# Altium project PCB_3U_CamLink.PrjPCB
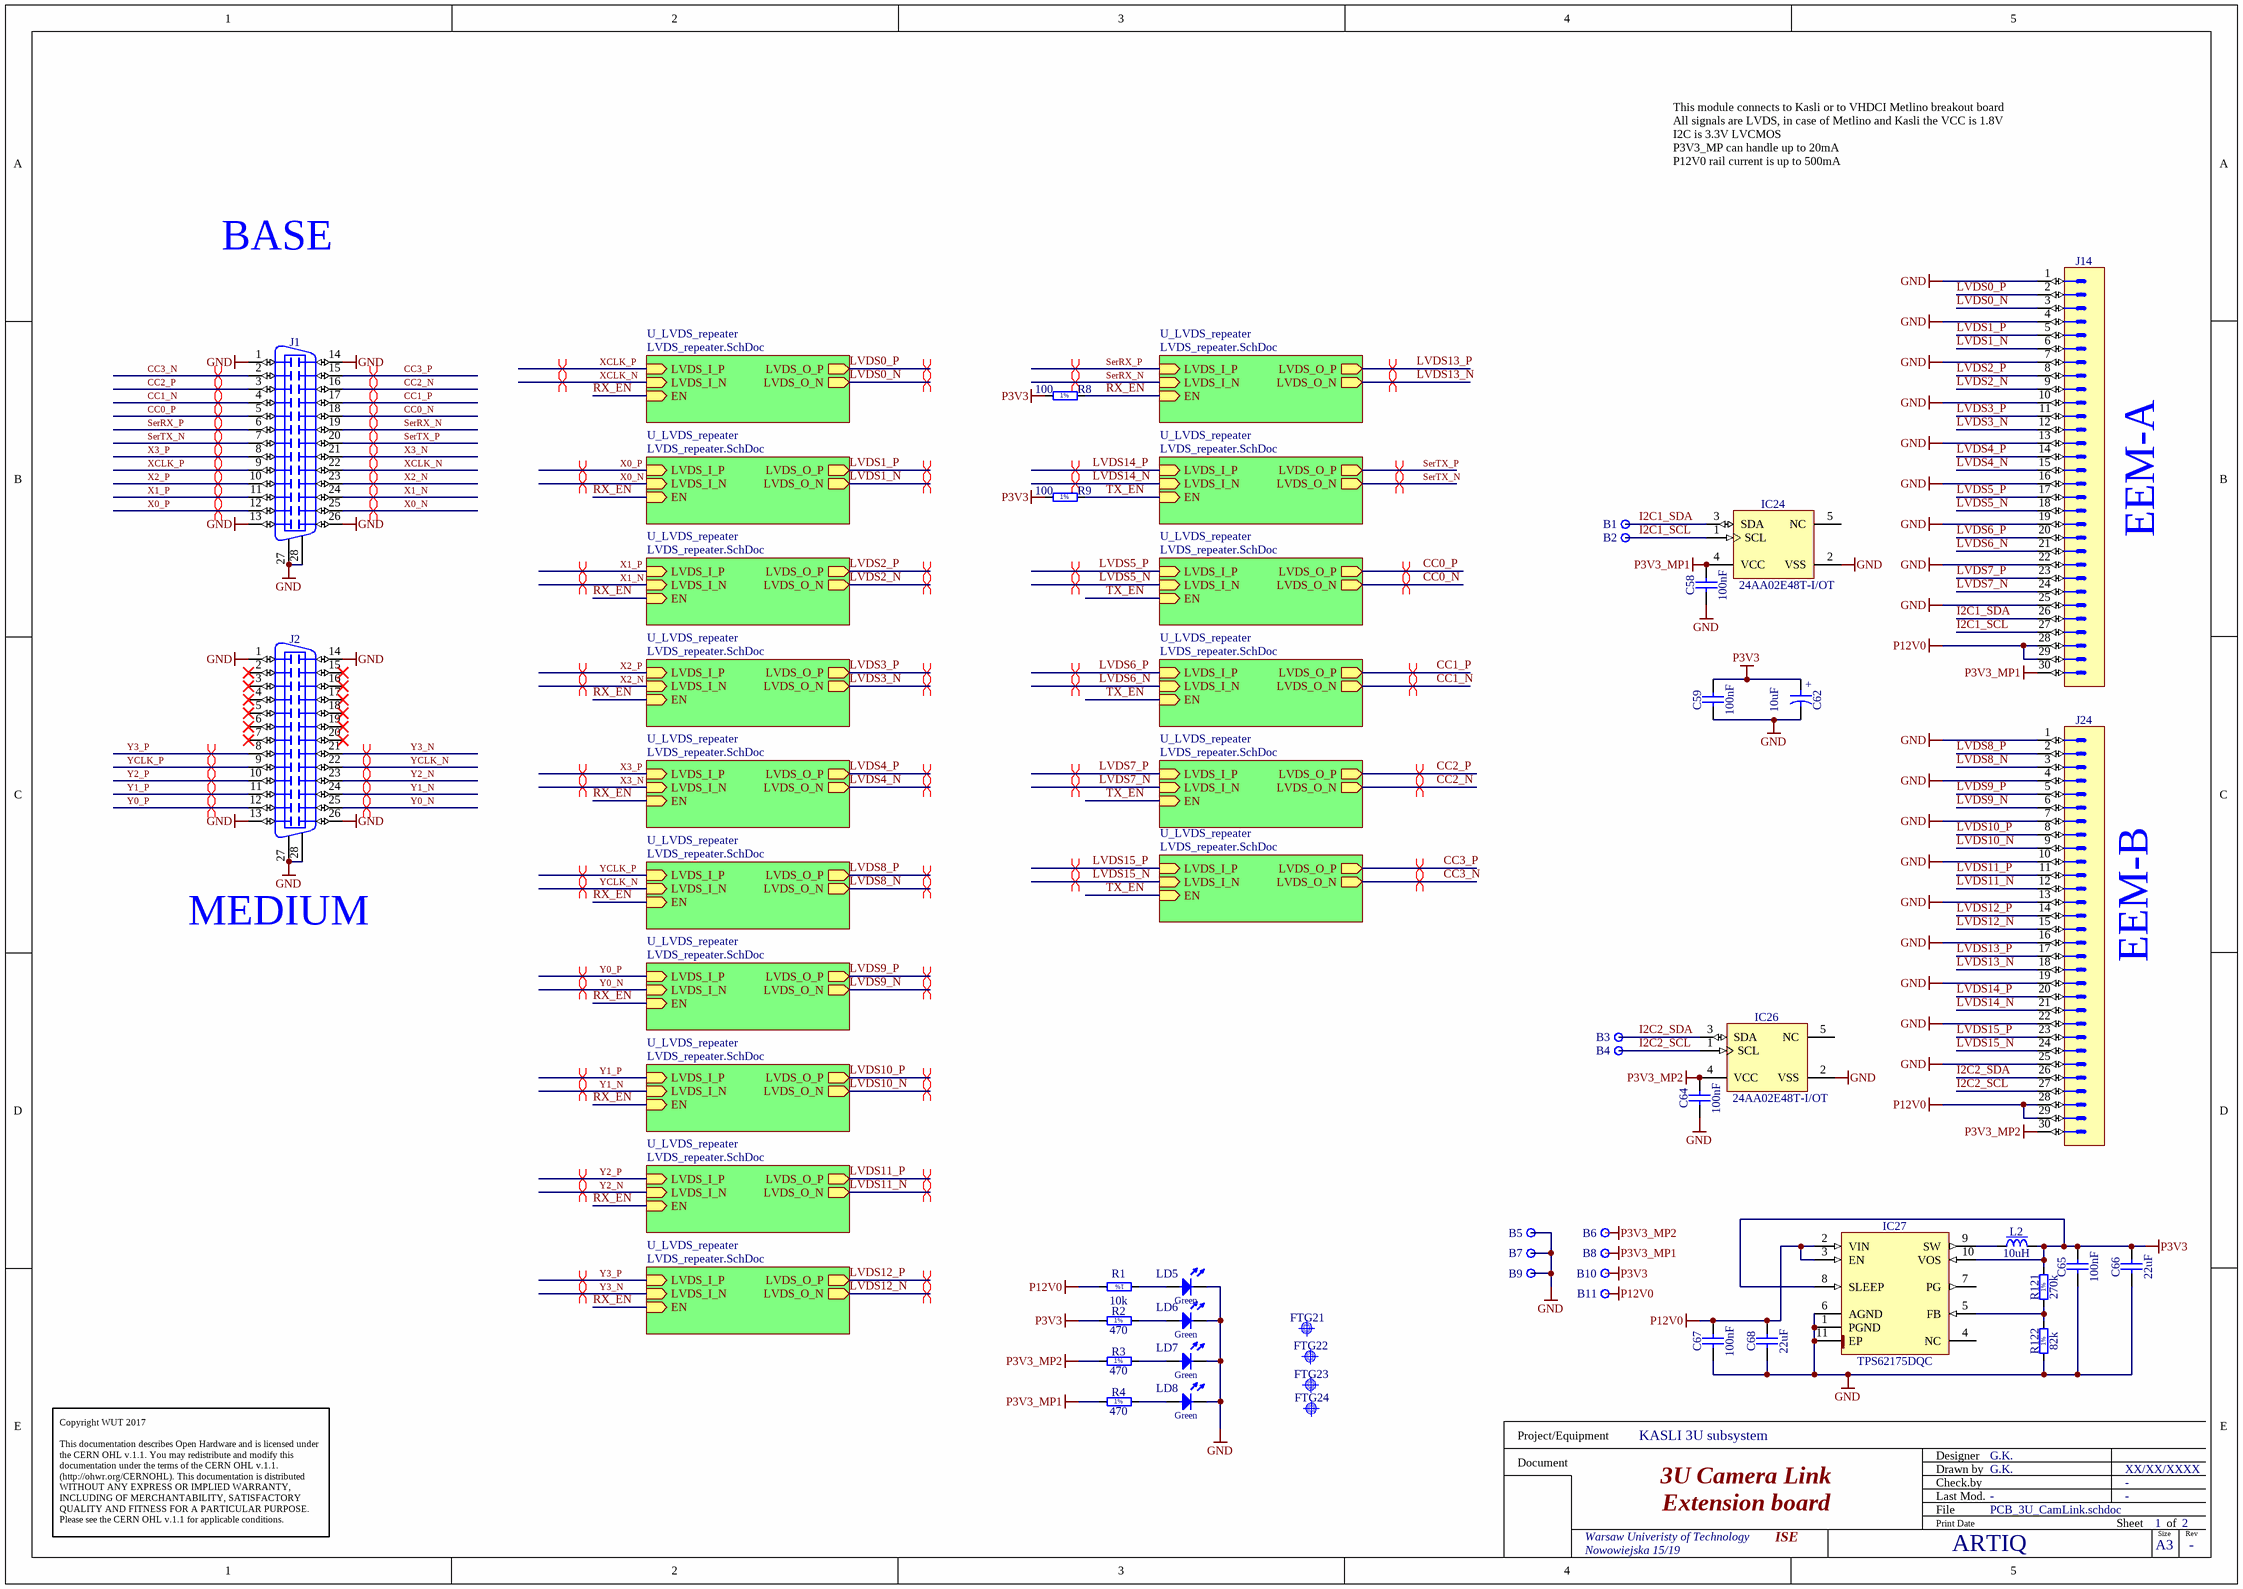
[diagram p0: PCB_3U_CamLink.schdoc]
2 sheets, 107 parts. Net scope: hierarchical (ports join the sheet entries above them; power ports are global).
Board file: PCB_3U_CamLink.PCBDOC
Sheets:
  PCB_3U_CamLink.schdoc
    U_LVDS_repeater = LVDS_repeater.SchDoc
    U_LVDS_repeater = LVDS_repeater.SchDoc
    U_LVDS_repeater = LVDS_repeater.SchDoc
    U_LVDS_repeater = LVDS_repeater.SchDoc
    U_LVDS_repeater = LVDS_repeater.SchDoc
    U_LVDS_repeater = LVDS_repeater.SchDoc
    U_LVDS_repeater = LVDS_repeater.SchDoc
    U_LVDS_repeater = LVDS_repeater.SchDoc
    U_LVDS_repeater = LVDS_repeater.SchDoc
    U_LVDS_repeater = LVDS_repeater.SchDoc
    U_LVDS_repeater = LVDS_repeater.SchDoc
    U_LVDS_repeater = LVDS_repeater.SchDoc
    U_LVDS_repeater = LVDS_repeater.SchDoc
    U_LVDS_repeater = LVDS_repeater.SchDoc
    U_LVDS_repeater = LVDS_repeater.SchDoc
    U_LVDS_repeater = LVDS_repeater.SchDoc

## Sheet PCB_3U_CamLink.schdoc: 3U Camera Link
size 420 x 297 mm; Author: G.K.; CompanyName: WUT; DrawnBy: G.K.; Organization: WUT; Address1: Warsaw Univeristy of Technology; Address2: Nowowiejska 15/19; DocumentNumber: 1; Revision: -; SheetNumber: 1; SheetTotal: 2; EDA_Number: ARTIQ; Projet: KASLI 3U subsystem; ModifiedBy: -; CreateDate: XX/XX/XXXX; CheckedDate: -; Title2: Extension board; DivGrp: ISE; Designer: G.K.; ModifiedDate: -; ProjectName: KASLI 3U subsystem

### Parts
B1  Plated Hole  [c130h60]  (value not drawn)
B2  Plated Hole  [c130h60]  (value not drawn)
B3  Plated Hole  [c130h60]  (value not drawn)
B4  Plated Hole  [c130h60]  (value not drawn)
B5  Plated Hole  [c130h60]  (value not drawn)
B6  Plated Hole  [c130h60]  (value not drawn)
B7  Plated Hole  [c130h60]  (value not drawn)
B8  Plated Hole  [c130h60]  (value not drawn)
B9  Plated Hole  [c130h60]  (value not drawn)
B10  Plated Hole  [c130h60]  (value not drawn)
B11  Plated Hole  [c130h60]  (value not drawn)
C58  100nF  [CAPC1005X55N]
C59  100nF  [CAPC1005X55N]
C62  10uF  [CAPAE430X540N]
C64  100nF  [CAPC1005X55N]
C65  100nF  [CAPC1005X55N]
C66  22uF  [CAPC2012X135N]
C67  100nF  [CAPC1005X55N]
C68  22uF  [CAPC2012X135N]
FTG21  Use only in PCB  [FIDUCIAL_TOP_C100-200]  (value not drawn)
FTG22  Use only in PCB  [FIDUCIAL_TOP_S100-200]  (value not drawn)
FTG23  Use only in PCB  [FIDUCIAL_TOP_S200-400]  (value not drawn)
FTG24  Use only in PCB  [FIDUCIAL_TOP_S100-200]  (value not drawn)
IC24  24AA02E48T-I/OT  [SOT95P280X145-5N]
IC26  24AA02E48T-I/OT  [SOT95P280X145-5N]
IC27  TPS62175DQC  [SON50P200X300X80-11N-R94X250]
J1  MDR 26  [3M_N10226-5212PC]  (value not drawn)
J2  MDR 26  [3M_N10226-5212PC]  (value not drawn)
J14  (no value)  [3M_N2530-6002RB]
J24  (no value)  [3M_N2530-6002RB]
L2  10uH  [IND_MURATA-PS_8400]
LD5  Green  [LED_KINGBRIGHT_KPH-1608CGCK]  (value not drawn)
LD6  Green  [LED_KINGBRIGHT_KPH-1608CGCK]  (value not drawn)
LD7  Green  [LED_KINGBRIGHT_KPH-1608CGCK]  (value not drawn)
LD8  Green  [LED_KINGBRIGHT_KPH-1608CGCK]  (value not drawn)
R1  10k  [RESC1005X40N]
R2  470  [RESC1005X40N]
R3  470  [RESC1005X40N]
R4  470  [RESC1005X40N]
R8  100  [RESC1005X40N]
R9  100  [RESC1005X40N]
R121  270k  [RESC1608X55N]
R122  82k  [RESC1608X55N]

### Sub-sheets
U_LVDS_repeater = LVDS_repeater.SchDoc: LVDS_I_P (in), LVDS_I_N (in), LVDS_O_P (out), LVDS_O_N (out), EN (in)
U_LVDS_repeater = LVDS_repeater.SchDoc: LVDS_I_P (in), LVDS_I_N (in), LVDS_O_P (out), LVDS_O_N (out), EN (in)
U_LVDS_repeater = LVDS_repeater.SchDoc: LVDS_I_P (in), LVDS_I_N (in), LVDS_O_P (out), LVDS_O_N (out), EN (in)
U_LVDS_repeater = LVDS_repeater.SchDoc: LVDS_I_P (in), LVDS_I_N (in), LVDS_O_P (out), LVDS_O_N (out), EN (in)
U_LVDS_repeater = LVDS_repeater.SchDoc: LVDS_I_P (in), LVDS_I_N (in), LVDS_O_P (out), LVDS_O_N (out), EN (in)
U_LVDS_repeater = LVDS_repeater.SchDoc: LVDS_I_P (in), LVDS_I_N (in), LVDS_O_P (out), LVDS_O_N (out), EN (in)
U_LVDS_repeater = LVDS_repeater.SchDoc: LVDS_I_P (in), LVDS_I_N (in), LVDS_O_P (out), LVDS_O_N (out), EN (in)
U_LVDS_repeater = LVDS_repeater.SchDoc: LVDS_I_P (in), LVDS_I_N (in), LVDS_O_P (out), LVDS_O_N (out), EN (in)
U_LVDS_repeater = LVDS_repeater.SchDoc: LVDS_I_P (in), LVDS_I_N (in), LVDS_O_P (out), LVDS_O_N (out), EN (in)
U_LVDS_repeater = LVDS_repeater.SchDoc: LVDS_I_P (in), LVDS_I_N (in), LVDS_O_P (out), LVDS_O_N (out), EN (in)
U_LVDS_repeater = LVDS_repeater.SchDoc: LVDS_I_P (in), LVDS_I_N (in), LVDS_O_P (out), LVDS_O_N (out), EN (in)
U_LVDS_repeater = LVDS_repeater.SchDoc: LVDS_I_P (in), LVDS_I_N (in), LVDS_O_P (out), LVDS_O_N (out), EN (in)
U_LVDS_repeater = LVDS_repeater.SchDoc: LVDS_I_P (in), LVDS_I_N (in), LVDS_O_P (out), LVDS_O_N (out), EN (in)
U_LVDS_repeater = LVDS_repeater.SchDoc: LVDS_I_P (in), LVDS_I_N (in), LVDS_O_P (out), LVDS_O_N (out), EN (in)
U_LVDS_repeater = LVDS_repeater.SchDoc: LVDS_I_P (in), LVDS_I_N (in), LVDS_O_P (out), LVDS_O_N (out), EN (in)
U_LVDS_repeater = LVDS_repeater.SchDoc: LVDS_I_P (in), LVDS_I_N (in), LVDS_O_P (out), LVDS_O_N (out), EN (in)

### Nets
GND: B5.1 B7.1 B9.1 C58.1 C59.1 C62.2 C64.1 C65.1 C66.1 C67.1 C68.1 IC24.2(VSS) IC26.2(VSS) IC27.1(PGND) IC27.6(AGND) IC27.11(EP) J1.1 J1.13 J1.14 J1.26 J1.27 J1.28 J2.1 J2.13 J2.14 J2.26 J2.27 J2.28 J14.1 J14.4 J14.7 J14.10 J14.13 J14.16 J14.19 J14.22 J14.25 J24.1 J24.4 J24.7 J24.10 J24.13 J24.16 J24.19 J24.22 J24.25 LD5.1(C) LD6.1(C) LD7.1(C) LD8.1(C) R122.1
P3V3: B10.1 C59.2 C62.1 C65.2 C66.2 IC27.8(SLEEP) IC27.10(VOS) L2.2 R2.1 R8.1 R9.1 R121.2
P3V3_MP1: B8.1 C58.2 IC24.4(VCC) J14.30 R4.1
P3V3_MP2: B6.1 C64.2 IC26.4(VCC) J24.30 R3.1
P12V0: B11.1 C67.2 C68.2 IC27.2(VIN) IC27.3(EN) J14.28 J14.29 J24.28 J24.29 R1.2
CC0_N: J1.18 ; sheet U_LVDS_repeater/LVDS_O_N
CC0_P: J1.5 ; sheet U_LVDS_repeater/LVDS_O_P
CC1_N: J1.4 ; sheet U_LVDS_repeater/LVDS_O_N
CC1_P: J1.17 ; sheet U_LVDS_repeater/LVDS_O_P
CC2_N: J1.16 ; sheet U_LVDS_repeater/LVDS_O_N
CC2_P: J1.3 ; sheet U_LVDS_repeater/LVDS_O_P
CC3_N: J1.2 ; sheet U_LVDS_repeater/LVDS_O_N
CC3_P: J1.15 ; sheet U_LVDS_repeater/LVDS_O_P
I2C1_SCL: B2.1 IC24.1(SCL) J14.27
I2C1_SDA: B1.1 IC24.3(SDA) J14.26
I2C2_SCL: B4.1 IC26.1(SCL) J24.27
I2C2_SDA: B3.1 IC26.3(SDA) J24.26
LVDS0_N: J14.3 ; sheet U_LVDS_repeater/LVDS_O_N
LVDS0_P: J14.2 ; sheet U_LVDS_repeater/LVDS_O_P
LVDS1_N: J14.6 ; sheet U_LVDS_repeater/LVDS_O_N
LVDS1_P: J14.5 ; sheet U_LVDS_repeater/LVDS_O_P
LVDS2_N: J14.9 ; sheet U_LVDS_repeater/LVDS_O_N
LVDS2_P: J14.8 ; sheet U_LVDS_repeater/LVDS_O_P
LVDS3_N: J14.12 ; sheet U_LVDS_repeater/LVDS_O_N
LVDS3_P: J14.11 ; sheet U_LVDS_repeater/LVDS_O_P
LVDS4_N: J14.15 ; sheet U_LVDS_repeater/LVDS_O_N
LVDS4_P: J14.14 ; sheet U_LVDS_repeater/LVDS_O_P
LVDS5_N: J14.18 ; sheet U_LVDS_repeater/LVDS_I_N
LVDS5_P: J14.17 ; sheet U_LVDS_repeater/LVDS_I_P
LVDS6_N: J14.21 ; sheet U_LVDS_repeater/LVDS_I_N
LVDS6_P: J14.20 ; sheet U_LVDS_repeater/LVDS_I_P
LVDS7_N: J14.24 ; sheet U_LVDS_repeater/LVDS_I_N
LVDS7_P: J14.23 ; sheet U_LVDS_repeater/LVDS_I_P
LVDS8_N: J24.3 ; sheet U_LVDS_repeater/LVDS_O_N
LVDS8_P: J24.2 ; sheet U_LVDS_repeater/LVDS_O_P
LVDS9_N: J24.6 ; sheet U_LVDS_repeater/LVDS_O_N
LVDS9_P: J24.5 ; sheet U_LVDS_repeater/LVDS_O_P
LVDS10_N: J24.9 ; sheet U_LVDS_repeater/LVDS_O_N
LVDS10_P: J24.8 ; sheet U_LVDS_repeater/LVDS_O_P
LVDS11_N: J24.12 ; sheet U_LVDS_repeater/LVDS_O_N
LVDS11_P: J24.11 ; sheet U_LVDS_repeater/LVDS_O_P
LVDS12_N: J24.15 ; sheet U_LVDS_repeater/LVDS_O_N
LVDS12_P: J24.14 ; sheet U_LVDS_repeater/LVDS_O_P
LVDS13_N: J24.18 ; sheet U_LVDS_repeater/LVDS_O_N
LVDS13_P: J24.17 ; sheet U_LVDS_repeater/LVDS_O_P
LVDS14_N: J24.21 ; sheet U_LVDS_repeater/LVDS_I_N
LVDS14_P: J24.20 ; sheet U_LVDS_repeater/LVDS_I_P
LVDS15_N: J24.24 ; sheet U_LVDS_repeater/LVDS_I_N
LVDS15_P: J24.23 ; sheet U_LVDS_repeater/LVDS_I_P
RX_EN: R8.2 ; sheet U_LVDS_repeater/EN, sheet U_LVDS_repeater/EN, sheet U_LVDS_repeater/EN, sheet U_LVDS_repeater/EN, sheet U_LVDS_repeater/EN, sheet U_LVDS_repeater/EN, sheet U_LVDS_repeater/EN, sheet U_LVDS_repeater/EN, sheet U_LVDS_repeater/EN, sheet U_LVDS_repeater/EN, sheet U_LVDS_repeater/EN
SerRX_N: J1.19 ; sheet U_LVDS_repeater/LVDS_I_N  [project net LVDS_I_N]
SerRX_P: J1.6 ; sheet U_LVDS_repeater/LVDS_I_P  [project net LVDS_I_P]
SerTX_N: J1.7 ; sheet U_LVDS_repeater/LVDS_O_N  [project net LVDS_O_N]
SerTX_P: J1.20 ; sheet U_LVDS_repeater/LVDS_O_P  [project net LVDS_O_P]
TX_EN: R9.2 ; sheet U_LVDS_repeater/EN, sheet U_LVDS_repeater/EN, sheet U_LVDS_repeater/EN, sheet U_LVDS_repeater/EN, sheet U_LVDS_repeater/EN
X0_N: J1.25 ; sheet U_LVDS_repeater/LVDS_I_N  [project net LVDS_I_N]
X0_P: J1.12 ; sheet U_LVDS_repeater/LVDS_I_P  [project net LVDS_I_P]
X1_N: J1.24 ; sheet U_LVDS_repeater/LVDS_I_N  [project net LVDS_I_N]
X1_P: J1.11 ; sheet U_LVDS_repeater/LVDS_I_P  [project net LVDS_I_P]
X2_N: J1.23 ; sheet U_LVDS_repeater/LVDS_I_N  [project net LVDS_I_N]
X2_P: J1.10 ; sheet U_LVDS_repeater/LVDS_I_P  [project net LVDS_I_P]
X3_N: J1.21 ; sheet U_LVDS_repeater/LVDS_I_N  [project net LVDS_I_N]
X3_P: J1.8 ; sheet U_LVDS_repeater/LVDS_I_P  [project net LVDS_I_P]
XCLK_N: J1.22 ; sheet U_LVDS_repeater/LVDS_I_N  [project net LVDS_I_N]
XCLK_P: J1.9 ; sheet U_LVDS_repeater/LVDS_I_P  [project net LVDS_I_P]
Y0_N: J2.25 ; sheet U_LVDS_repeater/LVDS_I_N  [project net LVDS_I_N]
Y0_P: J2.12 ; sheet U_LVDS_repeater/LVDS_I_P  [project net LVDS_I_P]
Y1_N: J2.24 ; sheet U_LVDS_repeater/LVDS_I_N  [project net LVDS_I_N]
Y1_P: J2.11 ; sheet U_LVDS_repeater/LVDS_I_P  [project net LVDS_I_P]
Y2_N: J2.23 ; sheet U_LVDS_repeater/LVDS_I_N  [project net LVDS_I_N]
Y2_P: J2.10 ; sheet U_LVDS_repeater/LVDS_I_P  [project net LVDS_I_P]
Y3_N: J2.21 ; sheet U_LVDS_repeater/LVDS_I_N  [project net LVDS_I_N]
Y3_P: J2.8 ; sheet U_LVDS_repeater/LVDS_I_P  [project net LVDS_I_P]
YCLK_N: J2.22 ; sheet U_LVDS_repeater/LVDS_I_N  [project net LVDS_I_N]
YCLK_P: J2.9 ; sheet U_LVDS_repeater/LVDS_I_P  [project net LVDS_I_P]
NetIC27_5: IC27.5(FB) R121.1 R122.2
NetIC27_9: IC27.9(SW) L2.1
NetLD5_2: LD5.2(A) R1.1
NetLD6_2: LD6.2(A) R2.2
NetLD7_2: LD7.2(A) R3.2
NetLD8_2: LD8.2(A) R4.2

Not connected (* = marked no-connect by the designer): IC24 5(NC); IC26 5(NC); IC27 4(NC) 7(PG); J2 2* 3* 4* 5* 6* 7* 15* 16* 17* 18* 19* 20*

### Layout directives
differential pair: CC0_N, CC0_P, CC1_N, CC1_P, CC2_N, CC2_P, CC3_N, CC3_P, LVDS0_N, LVDS0_P, LVDS1_N, LVDS1_P, LVDS2_N, LVDS2_P, LVDS3_N, LVDS3_P, LVDS4_N, LVDS4_P, LVDS5_N, LVDS5_P, LVDS6_N, LVDS6_P, LVDS7_N, LVDS7_P, LVDS8_N, LVDS8_P, LVDS9_N, LVDS9_P, LVDS10_N, LVDS10_P, LVDS11_N, LVDS11_P, LVDS12_N, LVDS12_P, LVDS13_N, LVDS13_P, LVDS14_N, LVDS14_P, LVDS15_N, LVDS15_P, LVDS_I_N, LVDS_I_P, LVDS_O_N, LVDS_O_P

### Notes on the sheet
- This module connects to Kasli or to VHDCI Metlino breakout board
  All signals are LVDS, in case of Metlino and Kasli the VCC is 1.8V
  I2C is 3.3V LVCMOS
  P3V3_MP can handle up to 20mA
  P12V0 rail current is up to 500mA
- BASE
- (near J14) EEM-A
- (near J2) MEDIUM
- (near J24) EEM-B
- Copyright WUT 2017
  This documentation describes Open Hardware and is licensed under the CERN OHL v.1.1. You may redistribute and modify this documentation under the terms of the CERN OHL v.1.1. (http://ohwr.org/CERNOHL). This documentation is distributed WITHOUT ANY EXPRESS OR IMPLIED WARRANTY, INCLUDING OF MERCHANTABILITY, SATISFACTORY QUALITY AND FITNESS FOR A PARTICULAR PURPOSE. Please see the CERN OHL v.1.1 for applicable conditions.
- Project/Equipment
- Document
- Designer
- Drawn by
- Check.by
- File
- Last Mod.
- Print Date
- Sheet
- Size
- A3
- of
- Rev
- (in symbol CAE430-540_10UF_16V_20%) +
- (in symbol R0402_10K_1%_0.0625W_100PPM) 1%
- (in symbol R0402_100R_1%_0.1W_100PPM) 1%
- (in symbol R0402_470R_1%_0.0625W_100PPM) 1%
- (in symbol R0603_82K_1%_0.1W_100PPM) 1%
- (in symbol R0603_270K_1%_0.1W_100PPM) 1%

### Library data of the parts
B1-B11 = PLATED_HOLE0.6_PAD1.3: Single Terminal Socket; Part Description: Plated Through Hole: Hole Dia.=0.6mm Pad Dia.=1.3mm; Mounted: No; Part Number: PLATED_HOLE0.6_PAD1.3; Component Kind: Standard (No BOM); Component Type: Standard (No BOM); Pin Count: 1; Family: Plated Hole; Socket: No; SMD: No; Sense: No; Status: None; ComponentHeight: 0mm; HelpURL: Undefined; Author: CERN DEM MR; CreateDate: 02.03.2016; LatestRevisionDate: 02.03.2016; PackageDescription: Plated Through Hole: Hole Dia.=0.6mm Pad Dia.=1.3mm
C58 C59 C64 C65 C67 = CC0402_100NF_16V_10%_X5R: Non-polarised capacitor; Part Description: SMD Multilayer Chip Ceramic Capacitor; Manufacturer: GENERIC; Manufacturer1 Part Number: GRM155R61C104KA88D; Voltage: 16V; TC: X5R; Tolerance: ±10%; Part Number: CC0402_100NF_16V_10%_X5R; Component Kind: Standard; Component Type: Standard; Pin Count: 2; Value: 100nF; Status: None; Manufacturer Part Number: CC0402_100NF_16V_10%_X5R; Case: 0402; Mounted: Yes; Socket: No; SMD: Yes; Sense: No; Manufacturer1 Example: MURATA; Manufacturer1 ComponentHeight: 0.55mm; HelpURL: \\cern.ch\dfs\Applications\Altium\Datasheets\CC0402_X5R_MURATA_GRM.pdf; Author: CERN DEM JLC; CreateDate: 10.12.2013; LatestRevisionDate: 10.12.2013
C62 = CAE430-540_10UF_16V_20%: Polarised capacitor; Part Description: Aluminum Electrolytic SMT Capacitor; Manufacturer: PANASONIC; Manufacturer Part Number: EEEFK1C100AR; Voltage: 16V; Tolerance: ±20%; Part Number: CAE430-540_10UF_16V_20%; Component Kind: Standard; Component Type: Standard; Pin Count: 2; Value: 10uF; Status: Not Recommended; Case: B; Mounted: Yes; Socket: No; SMD: Yes; Sense: No; ComponentHeight: 5.8mm; HelpURL: \\cern.ch\dfs\Applications\Altium\Datasheets\CAE_PANASONIC_FK.pdf; Author: CERN DEM JLC; CreateDate: 03.12.2007; LatestRevisionDate: 05.11.2014
C66 C68 = CC0805_22UF_16V_10%_X5R: Non-polarised capacitor; Part Description: SMD Multilayer Chip Ceramic Capacitor; Manufacturer: GENERIC; Manufacturer1 Part Number: C2012X5R1C226KT; Voltage: 16V; TC: X5R; Tolerance: ±10%; Part Number: CC0805_22UF_16V_10%_X5R; Component Kind: Standard; Component Type: Standard; Pin Count: 2; Value: 22uF; Status: Preferred; Manufacturer Part Number: CC0805_22UF_16V_10%_X5R; Case: 0805; Mounted: Yes; Socket: No; SMD: Yes; Sense: No; Manufacturer1 Example: TDK; Manufacturer1 ComponentHeight: 1.35mm; HelpURL: \\cern.ch\dfs\Applications\Altium\Datasheets\CC0805_X5R_TDK_C.pdf; Author: CERN DEM JLC; CreateDate: 25.10.2012; LatestRevisionDate: 25.10.2012
FTG21 = FIDUCIAL_TARGET_C100-200: Fiducial Target; Part Description: Round Fiducial Target, Top Layer, 1.0mm, Top Solder 2.0mm, Keepout =2.0mm; Mounted: No; Part Number: FIDUCIAL_TARGET_C100-200; Component Kind: Standard (No BOM); Component Type: Standard (No BOM); Pin Count: 1; Family: Fiducial; Socket: No; SMD: Yes; Sense: No; Status: None; ComponentHeight: 0mm; HelpURL: Undefined; Author: CERN DEM JLC; CreateDate: 09.02.2010; LatestRevisionDate: 04.04.2012; PackageDescription: Round Fiducial Target, Top Layer, 1.0mm, Top Solder 2.0mm, Keepout =2.0mm
FTG22 FTG24 = FIDUCIAL_TARGET_S100-200: Fiducial Target; Part Description: Square Fiducial Target, Top Layer, 1.0mm, Top Solder 2.0mm, Keepout =2.0mm; Mounted: No; Part Number: FIDUCIAL_TARGET_S100-200; Component Kind: Standard (No BOM); Component Type: Standard (No BOM); Pin Count: 1; Family: Fiducial; Socket: No; SMD: Yes; Sense: No; Status: None; ComponentHeight: 0mm; HelpURL: Undefined; Author: CERN DEM JLC; CreateDate: 09.02.2010; LatestRevisionDate: 04.04.2012; PackageDescription: Square Fiducial Target, Top Layer, 1.0mm, Top Solder 2.0mm, Keepout =2.0mm
FTG23 = FIDUCIAL_TARGET_S200-400: Fiducial Target; Part Description: Square Fiducial Target, Top Layer, 2.0mm, Top Solder 4.0mm, Keepout =4.0mm; Mounted: No; Part Number: FIDUCIAL_TARGET_S200-400; Component Kind: Standard (No BOM); Component Type: Standard (No BOM); Pin Count: 1; Family: Fiducial; Socket: No; SMD: Yes; Sense: No; Status: None; ComponentHeight: 0mm; HelpURL: Undefined; Author: CERN DEM JLC; CreateDate: 02.06.2008; LatestRevisionDate: 04.04.2012; PackageDescription: Square Fiducial Target, Top Layer, 2.0mm, Top Solder 4.0mm, Keepout =4.0mm
IC24 IC26 = 24AA02E48T-I/OT: 1.7V-5.5V, 2K I2C Serial EEPROM With EUI-48 Node Identity; Manufacturer: MICROCHIP TECHNOLOGY; PressFit: No; Bonding: No; Part Number: 24AA02E48T-I/OT; Component Kind: Standard; Component Type: Standard; Device: 24AA02E48T-I/OT; PackageDescription: SOT, 0.95mm pitch; 5 pin, 1.60mm W X 2.90mm L X 1.45mm H body, IPC Medium Density; Part Description: 1.7V-5.5V, 2K I2C Serial EEPROM With EUI-48 Node Identity; Manufacturer Part Number: 24AA02E48T-I/OT; Pin Count: 5; Case: SOT23-5; Mounted: Yes; Socket: No; SMD: Yes; Sense: No; ComponentHeight: 1.45mm; HelpURL: \\cern.ch\dfs\Applications\Altium\Datasheets\24AA02E48T-I-OT.pdf; Author: CERN DEM MR; CreateDate: 31.03.2016; LatestRevisionDate: 31.03.2016
IC27 = TPS62175DQC: 4.75-28VDC to 1-6VDC, 500mA Step-Down Converter With Sleep Mode; Manufacturer: TEXAS INSTRUMENTS; PressFit: No; Bonding: No; Part Number: TPS62175DQC; Component Kind: Standard; Component Type: Standard; Device: TPS62175DQC; PackageDescription: SON, 10-Leads, Body 2x3mm, Pitch 0.5mm, Thermal Pad 0.94x2.5mm, IPC Medium Density; Part Description: 4.75-28VDC to 1-6VDC, 500mA Step-Down Converter With Sleep Mode; Manufacturer Part Number: TPS62175DQC; Pin Count: 11; Case: SON10; Mounted: Yes; Socket: No; SMD: Yes; Sense: No; ComponentHeight: 0.8mm; HelpURL: \\cern.ch\dfs\Applications\Altium\Datasheets\TPS62175DQC.pdf; Author: CERN DEM JMW; CreateDate: 11.08.2015; LatestRevisionDate: 11.08.2015
J1 J2 = 3M_N10226-5212PC: Connector Mini D Ribbon (MDR) 26 Female; Part Description: 26 contacts, Mini D Ribbon (MDR), .050" Boardmount Through-hole Right Angle Receptacle-Shielded, Diecast Body, 102 Series; Manufacturer: 3M; PressFit: No; Part Number: 3M_N10226-5212PC; Component Kind: Standard; Component Type: Standard; Pin Count: 28; Family: MDR 26; Mounted: Yes; Socket: No; SMD: No; Sense: No; Status: None; Manufacturer Part Number: N10226-5212PC; ComponentHeight: 9.4mm; HelpURL: \\cern.ch\dfs\Applications\Altium\Datasheets\3M_N10226-5212PC.pdf; Author: CERN DEM JLC; CreateDate: 18.11.2008; LatestRevisionDate: 14.10.2009
J14 J24 = 3M_N2530-6002RB: Connector 30 Male; Part Description: 30 Contacts - Straight .100'' x .100'' Low Profile Four-Wall Header, 2500 Series; Manufacturer: 3M; PressFit: No; Part Number: 3M_N2530-6002RB; Component Kind: Standard; Component Type: Standard; Pin Count: 30; Family: Header 30; Mounted: Yes; Socket: No; SMD: No; Sense: No; Status: None; Manufacturer Part Number: N2530-6002RB; ComponentHeight: 10.03mm; HelpURL: \\cern.ch\dfs\Applications\Altium\Datasheets\3M_N2530-6002RB.pdf; Author: CERN DEM JLC; CreateDate: 11.02.2009; LatestRevisionDate: 11.08.2009
L2 = IND_10UH_10%_MURATA-PS_8400: Inductor With Core; Part Description: Miniature Surface Mount Power Inductor (8400 Serie); Manufacturer: MURATA POWER SOLUTIONS; Manufacturer Part Number: 84103C; Power: 950mA; Resistance: 0.24R; Tolerance: ±10%; Part Number: IND_10UH_10%_MURATA-PS_8400; Component Kind: Standard; Component Type: Standard; Pin Count: 2; Value: 10uH; Status: None; Mounted: Yes; Socket: No; SMD: Yes; Sense: No; ComponentHeight: 2.9mm; HelpURL: \\cern.ch\dfs\Applications\Altium\Datasheets\IND_MURATA-PS_8400.pdf; Author: CERN DEM JLC; CreateDate: 02.07.2012; LatestRevisionDate: 02.07.2012
LD5-LD8 = LED_KINGBRIGHT_KPH-1608CGCK: LED Green 1C 2A; Part Description: SMD Green LED, Case 1.6mmX0.8mm(0603), 0.65mm Thickness; PressFit: No; Bonding: No; Part Number: LED_KINGBRIGHT_KPH-1608CGCK; Component Kind: Standard; Component Type: Standard; Color: Green; PackageDescription: SMT Green LED, Case 0603, Body L 1.6 x W 0.8mm H 0.65mm; Manufacturer: KINGBRIGHT; Manufacturer Part Number: KPH-1608CGCK; Pin Count: 2; Mounted: Yes; Socket: No; SMD: Yes; Sense: No; ComponentHeight: 0.65mm; HelpURL: \\cern.ch\dfs\Applications\Altium\Datasheets\LED_KINGBRIGHT_KPH-1608CGCK.pdf; Author: CERN DEM JLC; CreateDate: 03.07.2017; LatestRevisionDate: 03.07.2017
R1 = R0402_10K_1%_0.0625W_100PPM: Resistor - 1%; Part Description: General Purpose Thick Film Chip Resistor; Manufacturer: GENERIC; Manufacturer1 Part Number: 232270671003L; TC: ±100ppm/°C; Part Number: R0402_10K_1%_0.0625W_100PPM; Component Kind: Standard; Component Type: Standard; Pin Count: 2; Value: 10k; Status: Not recommended; Power: 0.0625W; Tolerance: ±1%; Manufacturer Part Number: R0402_10K_1%_0.0625W_100PPM; Case: 0402; Mounted: Yes; Sense: No; Socket: No; SMD: Yes; Manufacturer1 Example: YAGEO PHYCOMP; Manufacturer1 ComponentHeight: 0.4mm; HelpURL: \\cern.ch\dfs\Applications\Altium\Datasheets\R0402_Phycomp_RC0402.pdf; Author: CERN DEM JLC; CreateDate: 03.12.2007; LatestRevisionDate: 17.10.2012
R2-R4 = R0402_470R_1%_0.0625W_100PPM: Resistor - 1%; Part Description: General Purpose Thick Film Chip Resistor; Manufacturer: GENERIC; Manufacturer1 Part Number: 232270674701L; TC: ±100ppm/°C; PressFit: No; Part Number: R0402_470R_1%_0.0625W_100PPM; Component Kind: Standard; Component Type: Standard; Pin Count: 2; Value: 470; Status: Not Recommended; Power: 0.0625W; Tolerance: ±1%; Manufacturer Part Number: R0402_470R_1%_0.0625W_100PPM; Case: 0402; Mounted: Yes; Sense: No; Socket: No; SMD: Yes; Manufacturer1 Example: YAGEO PHYCOMP; Manufacturer1 ComponentHeight: 0.4mm; HelpURL: \\cern.ch\dfs\Applications\Altium\Datasheets\R0402_Phycomp_RC0402.pdf; Author: CERN DEM JLC; CreateDate: 03.12.2007; LatestRevisionDate: 17.10.2012
R8 R9 = R0402_100R_1%_0.1W_100PPM: Resistor - 1%; Part Description: General Purpose Thick Film Chip Resistor; Manufacturer: GENERIC; Manufacturer Part Number: R0402_100R_1%_0.1W_100PPM_50V; Manufacturer1 Part Number: ERJ2RKF1000X; Power: 0.1W; TC: ±100ppm/°C; Voltage: 50V; Part Number: R0402_100R_1%_0.1W_100PPM; Component Kind: Standard; Component Type: Standard; Pin Count: 2; Value: 100; Status: Not recommended; Tolerance: ±1%; Case: 0402; Mounted: Yes; Sense: No; Socket: No; SMD: Yes; Manufacturer1 Example: PANASONIC; Manufacturer1 ComponentHeight: 0.4mm; HelpURL: \\cern.ch\dfs\Applications\Altium\Datasheets\R0402_PANASONIC_ERJ2RK.pdf; Author: CERN DEM JLC; CreateDate: 12.12.2013; LatestRevisionDate: 03.03.2015
R121 = R0603_270K_1%_0.1W_100PPM: Resistor - 1%; Part Description: General Purpose Thick Film Chip Resistor; Manufacturer: GENERIC; Manufacturer1 Part Number: NRC06F2703TRF; Power: 0.1W; TC: ±100ppm/°C; Part Number: R0603_270K_1%_0.1W_100PPM; Component Kind: Standard; Component Type: Standard; Pin Count: 2; Value: 270k; Status: Preferred; Tolerance: ±1%; Manufacturer Part Number: R0603_270K_1%_0.1W_100PPM; Case: 0603; Mounted: Yes; Sense: No; Socket: No; SMD: Yes; Manufacturer1 Example: NIC COMPONENT; Manufacturer1 ComponentHeight: 0.55mm; HelpURL: \\cern.ch\dfs\Applications\Altium\Datasheets\R0603_NIC_NRC.pdf; Author: CERN DEM JLC; CreateDate: 03.12.2007; LatestRevisionDate: 13.03.2008
R122 = R0603_82K_1%_0.1W_100PPM: Resistor - 1%; Part Description: General Purpose Thick Film Chip Resistor; Manufacturer: GENERIC; Manufacturer1 Part Number: NRC06F8202TRF; Power: 0.1W; TC: ±100ppm/°C; Part Number: R0603_82K_1%_0.1W_100PPM; Component Kind: Standard; Component Type: Standard; Pin Count: 2; Value: 82k; Status: Preferred; Tolerance: ±1%; Manufacturer Part Number: R0603_82K_1%_0.1W_100PPM; Case: 0603; Mounted: Yes; Sense: No; Socket: No; SMD: Yes; Manufacturer1 Example: NIC COMPONENT; Manufacturer1 ComponentHeight: 0.55mm; HelpURL: \\cern.ch\dfs\Applications\Altium\Datasheets\R0603_NIC_NRC.pdf; Author: CERN DEM JLC; CreateDate: 03.12.2007; LatestRevisionDate: 13.03.2008

## Sheet LVDS_repeater.SchDoc: SIngle channel
size 420 x 297 mm; Author: G.K.; CompanyName: WUT; DrawnBy: G.K.; Organization: CERN; Address1: Warsaw Univeristy of Technology; Address2: Nowowiejska 15/19; Revision: -; SheetNumber: -; SheetTotal: -; EDA_Number: ARTIQ; Projet: KASLI 3U subsystem; ModifiedBy: -; CreateDate: XX/XX/XXXX; CheckedDate: -; Title2: LVDS repeater; DivGrp: ISE; Designer: G.K.; ModifiedDate: -; ProjectName: KASLI 3U subsystem
Used 16 times, as channels U_LVDS_repeater, U_LVDS_repeater, U_LVDS_repeater, U_LVDS_repeater, U_LVDS_repeater, U_LVDS_repeater, U_LVDS_repeater, U_LVDS_repeater, U_LVDS_repeater, U_LVDS_repeater, U_LVDS_repeater, U_LVDS_repeater, U_LVDS_repeater, U_LVDS_repeater, U_LVDS_repeater, U_LVDS_repeater. Parts and nets are listed once, with the designators drawn on the sheet.
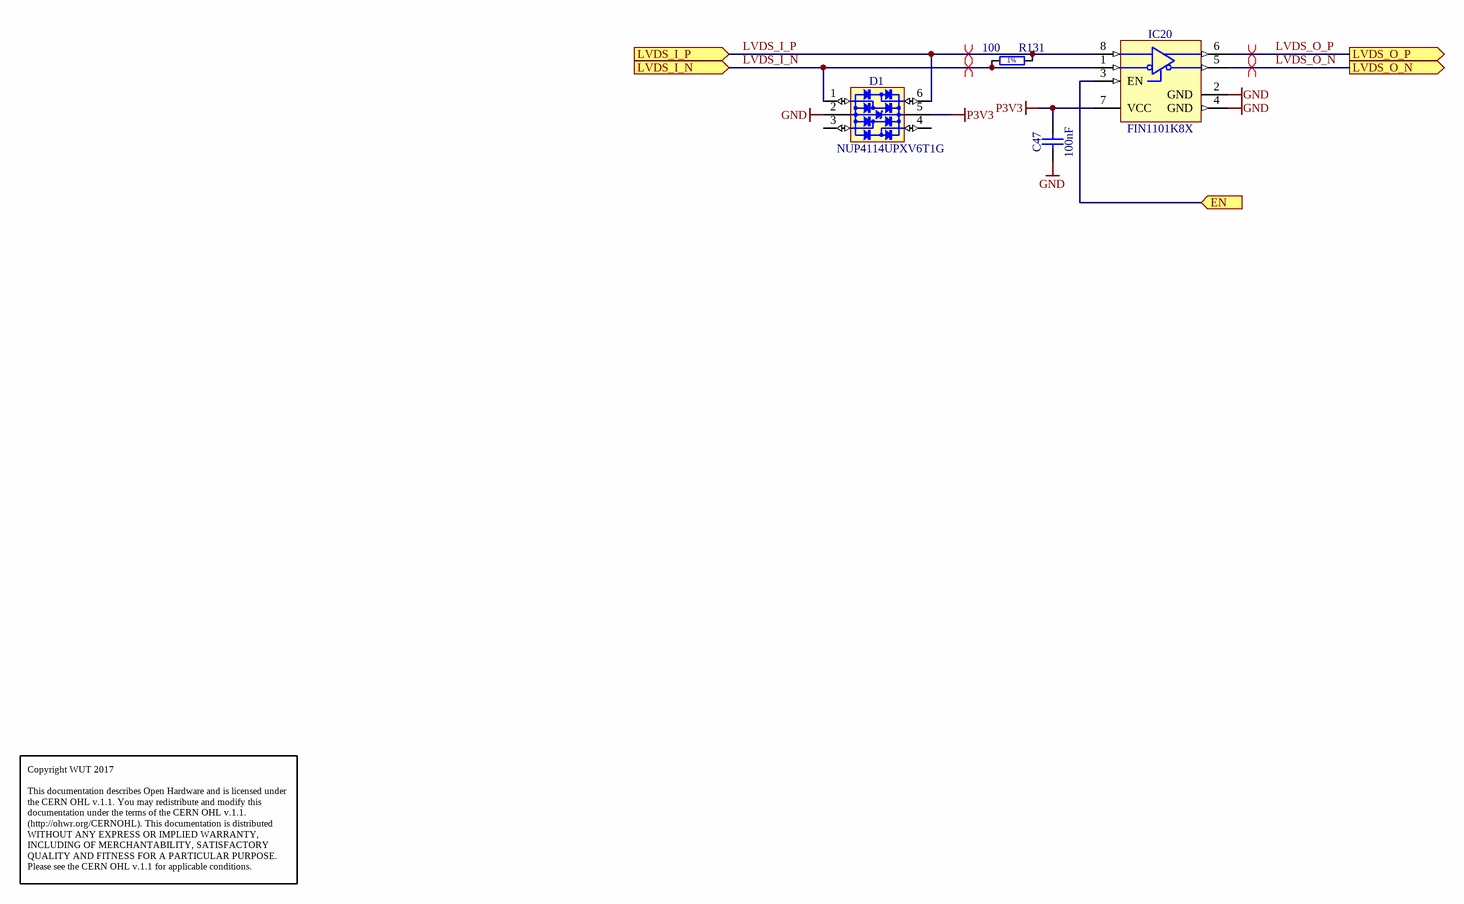
[diagram p1: LVDS_repeater.SchDoc]

### Parts
C47  100nF  [CAPC1005X55N]
D1  NUP4114UPXV6T1G  [SOTFL50P160X60-6N]
IC20  FIN1101K8X  [SOP50P310X90-8N]
R131  100  [RESC1005X40N]

### Ports
EN (in), LVDS_I_N (in), LVDS_I_P (in), LVDS_O_N (out), LVDS_O_P (out)

### Nets
GND: C47.1 D1.2(GND) IC20.2(GND) IC20.4(GND)
P3V3: C47.2 D1.5(VBUS) IC20.7(VCC)
EN: IC20.3(EN) ; port EN
LVDS_I_N: D1.1(I/O1) IC20.1(RIN-) R131.1 ; port LVDS_I_N
LVDS_I_P: D1.6(I/O4) IC20.8(RIN+) R131.2 ; port LVDS_I_P
LVDS_O_N: IC20.5(DOUT-) ; port LVDS_O_N
LVDS_O_P: IC20.6(DOUT+) ; port LVDS_O_P

Not connected (* = marked no-connect by the designer): D1 3(I/O2) 4(I/O3)

### Channels
U_LVDS_repeater: designators C47=C47P D1=D1A IC20=IC20P R131=R131P; ports EN=RX_EN LVDS_I_N=LVDS_I_N LVDS_I_P=LVDS_I_P LVDS_O_N=LVDS0_N LVDS_O_P=LVDS0_P
U_LVDS_repeater: designators C47=C47O D1=D1B IC20=IC20O R131=R131O; ports EN=RX_EN LVDS_I_N=LVDS_I_N LVDS_I_P=LVDS_I_P LVDS_O_N=LVDS1_N LVDS_O_P=LVDS1_P
U_LVDS_repeater: designators C47=C47N D1=D1C IC20=IC20N R131=R131N; ports EN=RX_EN LVDS_I_N=LVDS_I_N LVDS_I_P=LVDS_I_P LVDS_O_N=LVDS2_N LVDS_O_P=LVDS2_P
U_LVDS_repeater: designators C47=C47M D1=D1D IC20=IC20M R131=R131M; ports EN=RX_EN LVDS_I_N=LVDS_I_N LVDS_I_P=LVDS_I_P LVDS_O_N=LVDS3_N LVDS_O_P=LVDS3_P
U_LVDS_repeater: designators C47=C47L D1=D1E IC20=IC20L R131=R131L; ports EN=RX_EN LVDS_I_N=LVDS_I_N LVDS_I_P=LVDS_I_P LVDS_O_N=LVDS4_N LVDS_O_P=LVDS4_P
U_LVDS_repeater: designators C47=C47K D1=D1F IC20=IC20K R131=R131K; ports EN=RX_EN LVDS_I_N=LVDS_I_N LVDS_I_P=LVDS_I_P LVDS_O_N=LVDS8_N LVDS_O_P=LVDS8_P
U_LVDS_repeater: designators C47=C47J D1=D1G IC20=IC20J R131=R131J; ports EN=RX_EN LVDS_I_N=LVDS_I_N LVDS_I_P=LVDS_I_P LVDS_O_N=LVDS9_N LVDS_O_P=LVDS9_P
U_LVDS_repeater: designators C47=C47I D1=D1H IC20=IC20I R131=R131I; ports EN=RX_EN LVDS_I_N=LVDS_I_N LVDS_I_P=LVDS_I_P LVDS_O_N=LVDS10_N LVDS_O_P=LVDS10_P
U_LVDS_repeater: designators C47=C47H D1=D1I IC20=IC20H R131=R131H; ports EN=RX_EN LVDS_I_N=LVDS_I_N LVDS_I_P=LVDS_I_P LVDS_O_N=LVDS11_N LVDS_O_P=LVDS11_P
U_LVDS_repeater: designators C47=C47G D1=D1J IC20=IC20G R131=R131G; ports EN=RX_EN LVDS_I_N=LVDS_I_N LVDS_I_P=LVDS_I_P LVDS_O_N=LVDS12_N LVDS_O_P=LVDS12_P
U_LVDS_repeater: designators C47=C47F D1=D1K IC20=IC20F R131=R131F; ports EN=RX_EN LVDS_I_N=LVDS_I_N LVDS_I_P=LVDS_I_P LVDS_O_N=LVDS13_N LVDS_O_P=LVDS13_P
U_LVDS_repeater: designators C47=C47E D1=D1L IC20=IC20E R131=R131E; ports EN=TX_EN LVDS_I_N=LVDS14_N LVDS_I_P=LVDS14_P LVDS_O_N=LVDS_O_N LVDS_O_P=LVDS_O_P
U_LVDS_repeater: designators C47=C47D D1=D1M IC20=IC20D R131=R131D; ports EN=TX_EN LVDS_I_N=LVDS5_N LVDS_I_P=LVDS5_P LVDS_O_N=CC0_N LVDS_O_P=CC0_P
U_LVDS_repeater: designators C47=C47C D1=D1N IC20=IC20C R131=R131C; ports EN=TX_EN LVDS_I_N=LVDS6_N LVDS_I_P=LVDS6_P LVDS_O_N=CC1_N LVDS_O_P=CC1_P
U_LVDS_repeater: designators C47=C47B D1=D1O IC20=IC20B R131=R131B; ports EN=TX_EN LVDS_I_N=LVDS7_N LVDS_I_P=LVDS7_P LVDS_O_N=CC2_N LVDS_O_P=CC2_P
U_LVDS_repeater: designators C47=C47A D1=D1P IC20=IC20A R131=R131A; ports EN=TX_EN LVDS_I_N=LVDS15_N LVDS_I_P=LVDS15_P LVDS_O_N=CC3_N LVDS_O_P=CC3_P

### Layout directives
differential pair: LVDS0_N, LVDS0_P, LVDS_I_N, LVDS_I_P

### Notes on the sheet
- Copyright WUT 2017
  This documentation describes Open Hardware and is licensed under the CERN OHL v.1.1. You may redistribute and modify this documentation under the terms of the CERN OHL v.1.1. (http://ohwr.org/CERNOHL). This documentation is distributed WITHOUT ANY EXPRESS OR IMPLIED WARRANTY, INCLUDING OF MERCHANTABILITY, SATISFACTORY QUALITY AND FITNESS FOR A PARTICULAR PURPOSE. Please see the CERN OHL v.1.1 for applicable conditions.
- Project/Equipment
- Document
- Designer
- Drawn by
- Check.by
- File
- Last Mod.
- Print Date
- Sheet
- Size
- A3
- of
- Rev
- (in symbol R0402_100R_1%_0.1W_100PPM) 1%

### Library data of the parts
C47 = CC0402_100NF_16V_10%_X5R: as C58 on sheet PCB_3U_CamLink; Part Number: CC0402_100NF_16V_10%_X5R; Component Kind: Standard; Component Type: Standard; Pin Count: 2; Value: 100nF; Status: None; Manufacturer Part Number: CC0402_100NF_16V_10%_X5R; Case: 0402; Mounted: Yes; Socket: No; SMD: Yes; Sense: No; Manufacturer1 Example: MURATA; Manufacturer1 ComponentHeight: 0.55mm; HelpURL: \\cern.ch\dfs\Applications\Altium\Datasheets\CC0402_X5R_MURATA_GRM.pdf; Author: CERN DEM JLC; CreateDate: 10.12.2013; LatestRevisionDate: 10.12.2013
D1 = NUP4114UPXV6T1G: Part Description: ESD Protection Diodes Array (8kV) with Low Clamping Voltage; Manufacturer: ON SEMICONDUCTOR; Voltage: 5.5V; PressFit: No; Bonding: No; Part Number: NUP4114UPXV6T1G; Component Kind: Standard; Component Type: Standard; Device: NUP4114UPXV6T1G; PackageDescription: SOTFL (SOT666, SOT563,), 0.50mm, Pitch; 6 Pin, 1.20mm W X 1.60mm L X 0.60mm H Body, IPC Medium Density; Manufacturer Part Number: NUP4114UPXV6T1G; Pin Count: 8; Mounted: Yes; Socket: No; SMD: Yes; Sense: No; ComponentHeight: 1.75mm; HelpURL: \\cern.ch\dfs\Applications\Altium\Datasheets\NUP4114UPXV6T1G.pdf; Author: CERN DEM JLC; CreateDate: 05.12.2012; LatestRevisionDate: 05.12.2012
IC20 = FIN1101K8X: LVDS Single Port High Speed Repeater; Manufacturer: FAIRCHILD SEMICONDUCTOR; PressFit: No; Bonding: No; Part Number: FIN1101K8X; Component Kind: Standard; Component Type: Standard; Device: FIN1101K8X; PackageDescription: SOP, 0.50mm Pitch; 8 pin, 2.30mm W X 2.00mm L X 0.90mm H body, PC Medium Density; Part Description: LVDS Single Port High Speed Repeater; Manufacturer Part Number: FIN1101K8X; Pin Count: 8; Case: TSSOP8; Mounted: Yes; Socket: No; SMD: Yes; Sense: No; ComponentHeight: 0.8mm; Author: CERN DEM JLC; HelpURL: \\cern.ch\dfs\Applications\Altium\Datasheets\FIN1101K8X.pdf; CreateDate: 08.11.2016; LatestRevisionDate: 08.11.2016
R131 = R0402_100R_1%_0.1W_100PPM: as R8 on sheet PCB_3U_CamLink; Part Number: R0402_100R_1%_0.1W_100PPM; Component Kind: Standard; Component Type: Standard; Pin Count: 2; Value: 100; Status: Not recommended; Tolerance: ±1%; Case: 0402; Mounted: Yes; Sense: No; Socket: No; SMD: Yes; Manufacturer1 Example: PANASONIC; Manufacturer1 ComponentHeight: 0.4mm; HelpURL: \\cern.ch\dfs\Applications\Altium\Datasheets\R0402_PANASONIC_ERJ2RK.pdf; Author: CERN DEM JLC; CreateDate: 12.12.2013; LatestRevisionDate: 03.03.2015

## Nets that join several sheets
GND: PCB_3U_CamLink (51 pins), U_LVDS_repeater (C47P.1 D1A.2 IC20P.2 IC20P.4), U_LVDS_repeater (C47O.1 D1B.2 IC20O.2 IC20O.4), U_LVDS_repeater (C47N.1 D1C.2 IC20N.2 IC20N.4), U_LVDS_repeater (C47M.1 D1D.2 IC20M.2 IC20M.4), U_LVDS_repeater (C47L.1 D1E.2 IC20L.2 IC20L.4), U_LVDS_repeater (C47K.1 D1F.2 IC20K.2 IC20K.4), U_LVDS_repeater (C47J.1 D1G.2 IC20J.2 IC20J.4), U_LVDS_repeater (C47I.1 D1H.2 IC20I.2 IC20I.4), U_LVDS_repeater (C47H.1 D1I.2 IC20H.2 IC20H.4), U_LVDS_repeater (C47G.1 D1J.2 IC20G.2 IC20G.4), U_LVDS_repeater (C47F.1 D1K.2 IC20F.2 IC20F.4), U_LVDS_repeater (C47E.1 D1L.2 IC20E.2 IC20E.4), U_LVDS_repeater (C47D.1 D1M.2 IC20D.2 IC20D.4), U_LVDS_repeater (C47C.1 D1N.2 IC20C.2 IC20C.4), U_LVDS_repeater (C47B.1 D1O.2 IC20B.2 IC20B.4), U_LVDS_repeater (C47A.1 D1P.2 IC20A.2 IC20A.4)
P3V3: PCB_3U_CamLink (12 pins), U_LVDS_repeater (C47P.2 D1A.5 IC20P.7), U_LVDS_repeater (C47O.2 D1B.5 IC20O.7), U_LVDS_repeater (C47N.2 D1C.5 IC20N.7), U_LVDS_repeater (C47M.2 D1D.5 IC20M.7), U_LVDS_repeater (C47L.2 D1E.5 IC20L.7), U_LVDS_repeater (C47K.2 D1F.5 IC20K.7), U_LVDS_repeater (C47J.2 D1G.5 IC20J.7), U_LVDS_repeater (C47I.2 D1H.5 IC20I.7), U_LVDS_repeater (C47H.2 D1I.5 IC20H.7), U_LVDS_repeater (C47G.2 D1J.5 IC20G.7), U_LVDS_repeater (C47F.2 D1K.5 IC20F.7), U_LVDS_repeater (C47E.2 D1L.5 IC20E.7), U_LVDS_repeater (C47D.2 D1M.5 IC20D.7), U_LVDS_repeater (C47C.2 D1N.5 IC20C.7), U_LVDS_repeater (C47B.2 D1O.5 IC20B.7), U_LVDS_repeater (C47A.2 D1P.5 IC20A.7)
CC0_N: PCB_3U_CamLink (J1.18), U_LVDS_repeater (IC20D.5)
CC0_P: PCB_3U_CamLink (J1.5), U_LVDS_repeater (IC20D.6)
CC1_N: PCB_3U_CamLink (J1.4), U_LVDS_repeater (IC20C.5)
CC1_P: PCB_3U_CamLink (J1.17), U_LVDS_repeater (IC20C.6)
CC2_N: PCB_3U_CamLink (J1.16), U_LVDS_repeater (IC20B.5)
CC2_P: PCB_3U_CamLink (J1.3), U_LVDS_repeater (IC20B.6)
CC3_N: PCB_3U_CamLink (J1.2), U_LVDS_repeater (IC20A.5)
CC3_P: PCB_3U_CamLink (J1.15), U_LVDS_repeater (IC20A.6)
LVDS0_N: PCB_3U_CamLink (J14.3), U_LVDS_repeater (IC20P.5)
LVDS0_P: PCB_3U_CamLink (J14.2), U_LVDS_repeater (IC20P.6)
LVDS1_N: PCB_3U_CamLink (J14.6), U_LVDS_repeater (IC20O.5)
LVDS1_P: PCB_3U_CamLink (J14.5), U_LVDS_repeater (IC20O.6)
LVDS2_N: PCB_3U_CamLink (J14.9), U_LVDS_repeater (IC20N.5)
LVDS2_P: PCB_3U_CamLink (J14.8), U_LVDS_repeater (IC20N.6)
LVDS3_N: PCB_3U_CamLink (J14.12), U_LVDS_repeater (IC20M.5)
LVDS3_P: PCB_3U_CamLink (J14.11), U_LVDS_repeater (IC20M.6)
LVDS4_N: PCB_3U_CamLink (J14.15), U_LVDS_repeater (IC20L.5)
LVDS4_P: PCB_3U_CamLink (J14.14), U_LVDS_repeater (IC20L.6)
LVDS5_N: PCB_3U_CamLink (J14.18), U_LVDS_repeater (D1M.1 IC20D.1 R131D.1)
LVDS5_P: PCB_3U_CamLink (J14.17), U_LVDS_repeater (D1M.6 IC20D.8 R131D.2)
LVDS6_N: PCB_3U_CamLink (J14.21), U_LVDS_repeater (D1N.1 IC20C.1 R131C.1)
LVDS6_P: PCB_3U_CamLink (J14.20), U_LVDS_repeater (D1N.6 IC20C.8 R131C.2)
LVDS7_N: PCB_3U_CamLink (J14.24), U_LVDS_repeater (D1O.1 IC20B.1 R131B.1)
LVDS7_P: PCB_3U_CamLink (J14.23), U_LVDS_repeater (D1O.6 IC20B.8 R131B.2)
LVDS8_N: PCB_3U_CamLink (J24.3), U_LVDS_repeater (IC20K.5)
LVDS8_P: PCB_3U_CamLink (J24.2), U_LVDS_repeater (IC20K.6)
LVDS9_N: PCB_3U_CamLink (J24.6), U_LVDS_repeater (IC20J.5)
LVDS9_P: PCB_3U_CamLink (J24.5), U_LVDS_repeater (IC20J.6)
LVDS10_N: PCB_3U_CamLink (J24.9), U_LVDS_repeater (IC20I.5)
LVDS10_P: PCB_3U_CamLink (J24.8), U_LVDS_repeater (IC20I.6)
LVDS11_N: PCB_3U_CamLink (J24.12), U_LVDS_repeater (IC20H.5)
LVDS11_P: PCB_3U_CamLink (J24.11), U_LVDS_repeater (IC20H.6)
LVDS12_N: PCB_3U_CamLink (J24.15), U_LVDS_repeater (IC20G.5)
LVDS12_P: PCB_3U_CamLink (J24.14), U_LVDS_repeater (IC20G.6)
LVDS13_N: PCB_3U_CamLink (J24.18), U_LVDS_repeater (IC20F.5)
LVDS13_P: PCB_3U_CamLink (J24.17), U_LVDS_repeater (IC20F.6)
LVDS14_N: PCB_3U_CamLink (J24.21), U_LVDS_repeater (D1L.1 IC20E.1 R131E.1)
LVDS14_P: PCB_3U_CamLink (J24.20), U_LVDS_repeater (D1L.6 IC20E.8 R131E.2)
LVDS15_N: PCB_3U_CamLink (J24.24), U_LVDS_repeater (D1P.1 IC20A.1 R131A.1)
LVDS15_P: PCB_3U_CamLink (J24.23), U_LVDS_repeater (D1P.6 IC20A.8 R131A.2)
LVDS_I_N: PCB_3U_CamLink (J1.19), U_LVDS_repeater (D1K.1 IC20F.1 R131F.1)
LVDS_I_N: PCB_3U_CamLink (J1.21), U_LVDS_repeater (D1E.1 IC20L.1 R131L.1)
LVDS_I_N: PCB_3U_CamLink (J1.22), U_LVDS_repeater (D1A.1 IC20P.1 R131P.1)
LVDS_I_N: PCB_3U_CamLink (J1.23), U_LVDS_repeater (D1D.1 IC20M.1 R131M.1)
LVDS_I_N: PCB_3U_CamLink (J1.24), U_LVDS_repeater (D1C.1 IC20N.1 R131N.1)
LVDS_I_N: PCB_3U_CamLink (J1.25), U_LVDS_repeater (D1B.1 IC20O.1 R131O.1)
LVDS_I_N: PCB_3U_CamLink (J2.21), U_LVDS_repeater (D1J.1 IC20G.1 R131G.1)
LVDS_I_N: PCB_3U_CamLink (J2.22), U_LVDS_repeater (D1F.1 IC20K.1 R131K.1)
LVDS_I_N: PCB_3U_CamLink (J2.23), U_LVDS_repeater (D1I.1 IC20H.1 R131H.1)
LVDS_I_N: PCB_3U_CamLink (J2.24), U_LVDS_repeater (D1H.1 IC20I.1 R131I.1)
LVDS_I_N: PCB_3U_CamLink (J2.25), U_LVDS_repeater (D1G.1 IC20J.1 R131J.1)
LVDS_I_P: PCB_3U_CamLink (J1.6), U_LVDS_repeater (D1K.6 IC20F.8 R131F.2)
LVDS_I_P: PCB_3U_CamLink (J1.8), U_LVDS_repeater (D1E.6 IC20L.8 R131L.2)
LVDS_I_P: PCB_3U_CamLink (J1.9), U_LVDS_repeater (D1A.6 IC20P.8 R131P.2)
LVDS_I_P: PCB_3U_CamLink (J1.10), U_LVDS_repeater (D1D.6 IC20M.8 R131M.2)
LVDS_I_P: PCB_3U_CamLink (J1.11), U_LVDS_repeater (D1C.6 IC20N.8 R131N.2)
LVDS_I_P: PCB_3U_CamLink (J1.12), U_LVDS_repeater (D1B.6 IC20O.8 R131O.2)
LVDS_I_P: PCB_3U_CamLink (J2.8), U_LVDS_repeater (D1J.6 IC20G.8 R131G.2)
LVDS_I_P: PCB_3U_CamLink (J2.9), U_LVDS_repeater (D1F.6 IC20K.8 R131K.2)
LVDS_I_P: PCB_3U_CamLink (J2.10), U_LVDS_repeater (D1I.6 IC20H.8 R131H.2)
LVDS_I_P: PCB_3U_CamLink (J2.11), U_LVDS_repeater (D1H.6 IC20I.8 R131I.2)
LVDS_I_P: PCB_3U_CamLink (J2.12), U_LVDS_repeater (D1G.6 IC20J.8 R131J.2)
LVDS_O_N: PCB_3U_CamLink (J1.7), U_LVDS_repeater (IC20E.5)
LVDS_O_P: PCB_3U_CamLink (J1.20), U_LVDS_repeater (IC20E.6)
RX_EN: PCB_3U_CamLink (R8.2), U_LVDS_repeater (IC20P.3), U_LVDS_repeater (IC20O.3), U_LVDS_repeater (IC20N.3), U_LVDS_repeater (IC20M.3), U_LVDS_repeater (IC20L.3), U_LVDS_repeater (IC20K.3), U_LVDS_repeater (IC20J.3), U_LVDS_repeater (IC20I.3), U_LVDS_repeater (IC20H.3), U_LVDS_repeater (IC20G.3), U_LVDS_repeater (IC20F.3)
TX_EN: PCB_3U_CamLink (R9.2), U_LVDS_repeater (IC20E.3), U_LVDS_repeater (IC20D.3), U_LVDS_repeater (IC20C.3), U_LVDS_repeater (IC20B.3), U_LVDS_repeater (IC20A.3)